# Altium schematic sheet OTHER.SchDoc
size A3; SheetNumber: 3; SheetTotal: 5
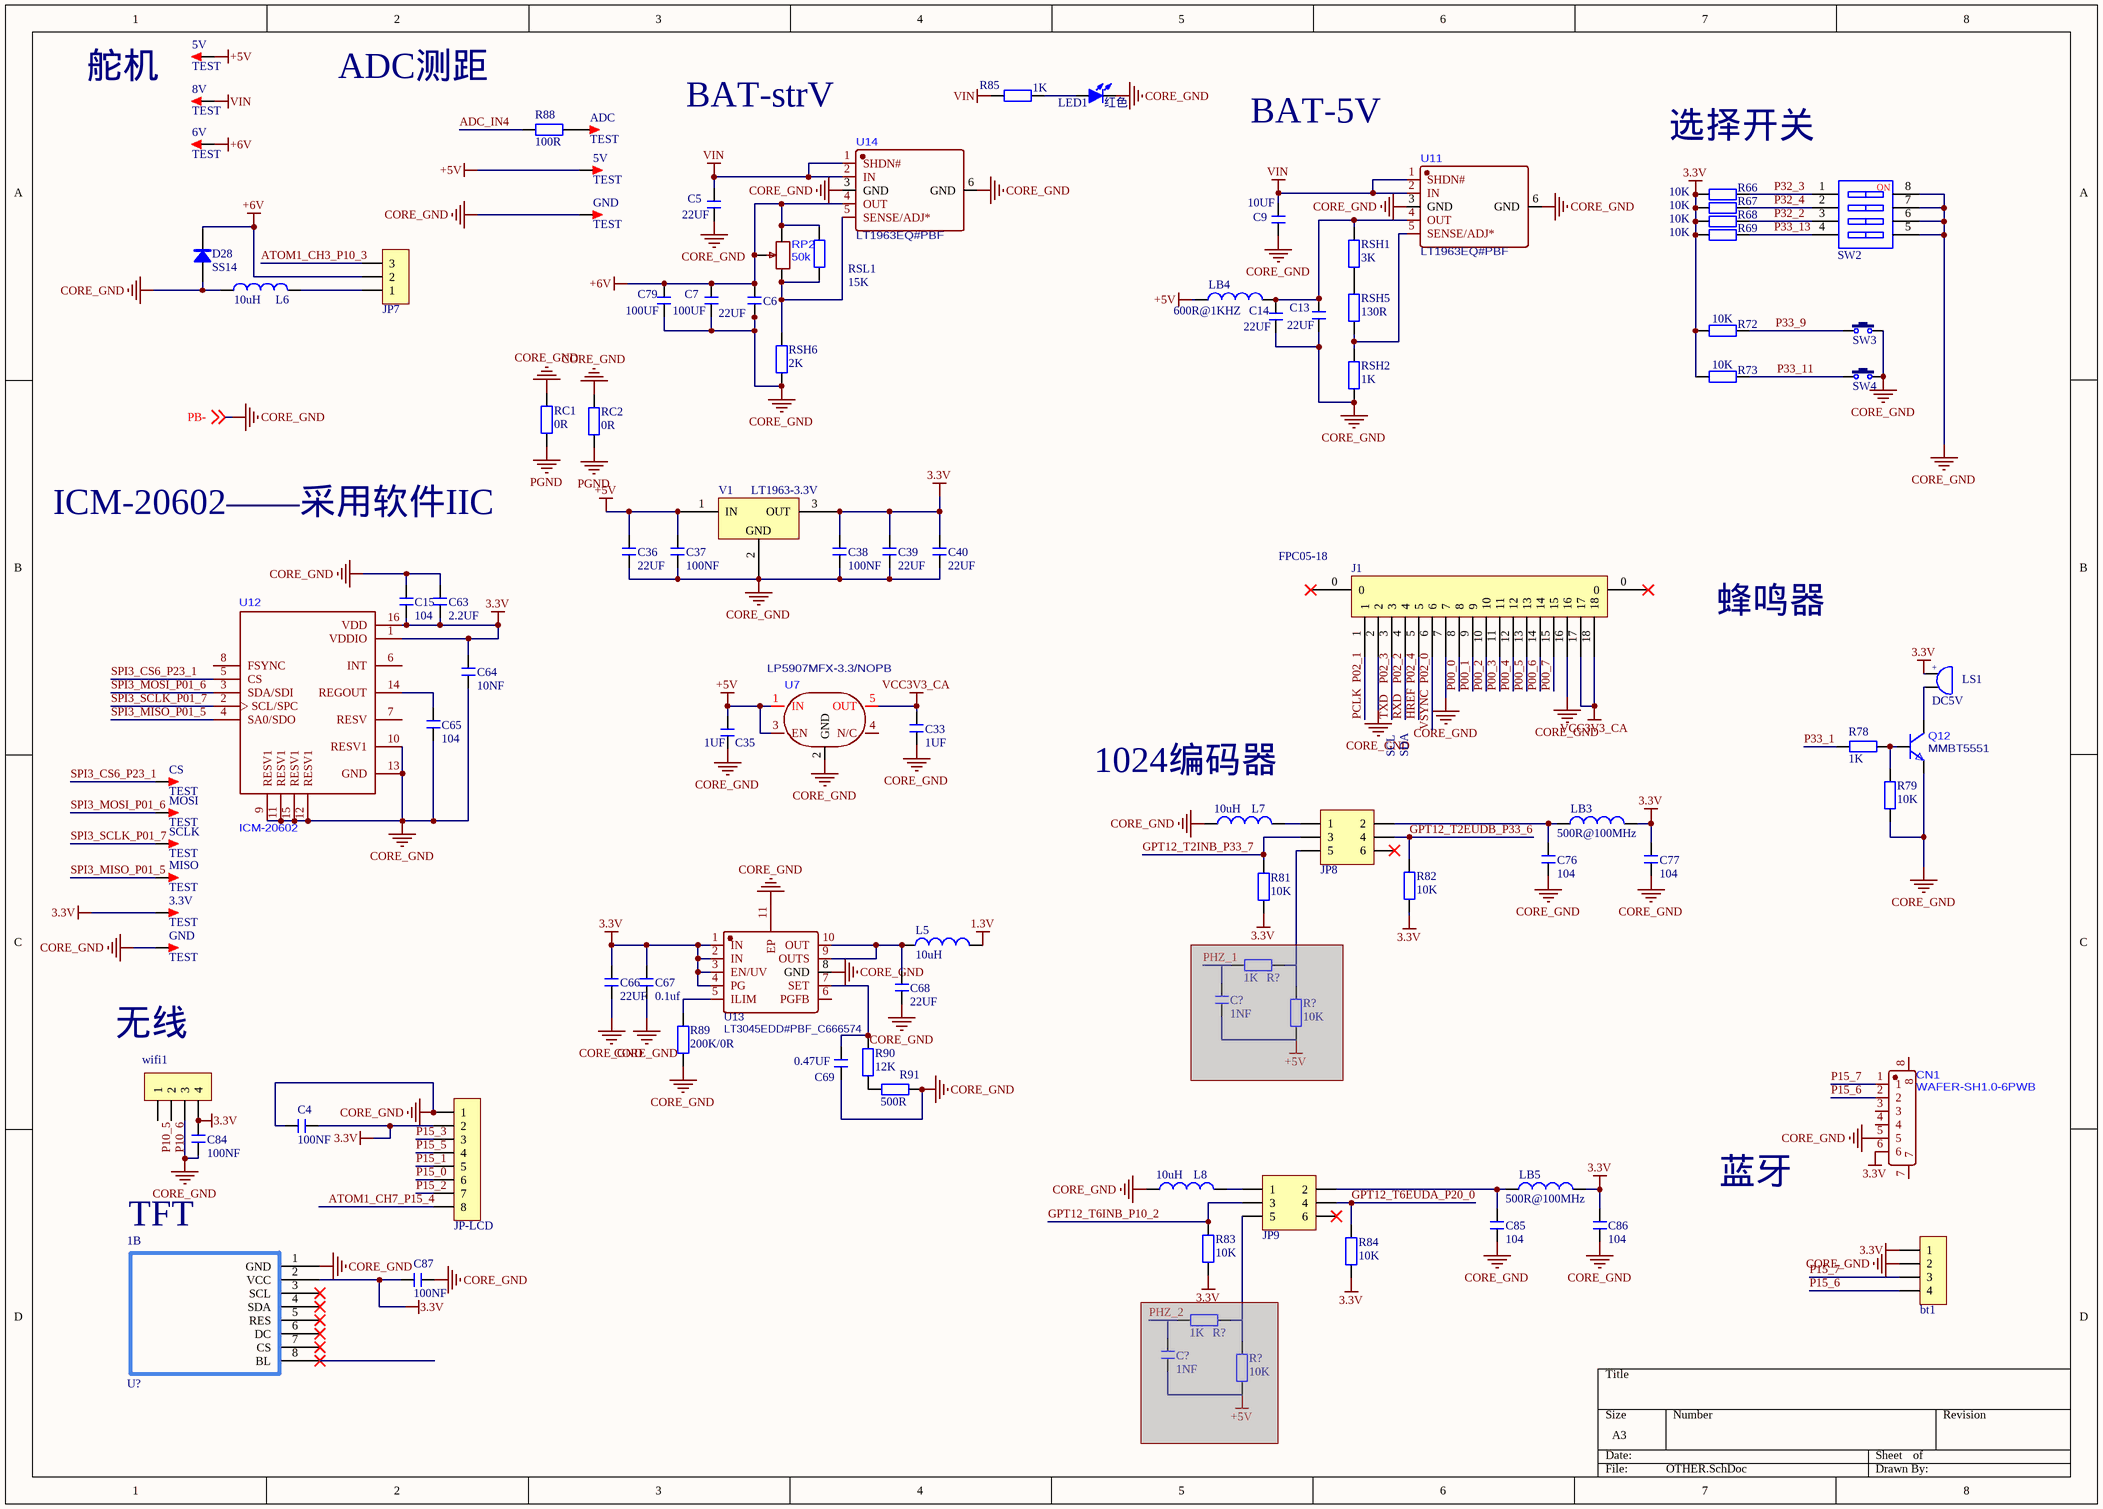
[diagram p0: OTHER.SchDoc]

## Parts
(Parts that share a designator on the sheet are numbered #1, #2 ... from top to bottom, then left to right.)
1  U?  [1.8'TFT]  (part B of 2)
3.3V  TEST  [TEST 0.8]
5V#1  TEST  [TEST 1.6]
5V#2  TEST  [TEST 1]
6V  TEST  [TEST 1.6]
8V  TEST  [TEST 1.6]
ADC  TEST  [TEST 1]
bt1  HDR-1X4  [HDR2.54-LI-4P]  (value not drawn)
C4  100NF  [C 0805_L]
C5  22UF  [C 1206_L]
C6  22UF  [C 1206_L]
C7  100UF  [C 1210_L]
C9  10UF  [C 0805_L]
C13  22UF  [C 1206_L]
C14  22UF  [C 1206_L]
C15  104  [C 0603_L]
C33  1UF  [C 0805_L]
C35  1UF  [C 0805_L]
C36  22UF  [C 1206_L]
C37  100NF  [C 0805_L]
C38  100NF  [C 0805_L]
C39  22UF  [C 1206_L]
C40  22UF  [C 1206_L]
C63  2.2UF  [C 0805_L]
C64  10NF  [C 0805_L]
C65  104  [C 0603_L]
C66  22UF  [C 1206_L]
C67  0.1uf  [C 0805_L]
C68  22UF  [C 1206_L]
C69  0.47UF  [C 0805_L]
C76  104  [C 0805_L]
C77  104  [C 0805_L]
C79  100UF  [C 1210_L]
C84  100NF  [C 0805_L]
C85  104  [C 0805_L]
C86  104  [C 0805_L]
C87  100NF  [C 0805_L]
C?#1  1NF  [C 0603_L]  (masked out: inside a compile mask, not in the netlist)
C?#2  1NF  [C 0603_L]  (masked out: inside a compile mask, not in the netlist)
CN1  WAFER-SH1.0-6PWB  [SH-SMD_6P-P1.00]
CS  TEST  [TEST 0.8]
D28  SS14  [SOD-123F]
GND#1  TEST  [TEST 1]
GND#2  TEST  [TEST 0.8]
J1  FPC05-18  [FPC-05mm-18]
JP7  HDR-1X3  [XH2.54-LI-3P]  (value not drawn)
JP8  Header3X2  [IDC2.54-LI-2x3P]  (value not drawn)
JP9  Header3X2  [IDC2.54-LI-2x3P]  (value not drawn)
JP-LCD  HDR-1X8  [HDR2.54-LI-8P]  (value not drawn)
L5  10uH  [L 0805_L]
L6  10uH  [L 0805_L]
L7  10uH  [L 0805_L]
L8  10uH  [L 0805_L]
LB3  500R@100MHz  [FB 0805_L]
LB4  600R@1KHZ  [L 0805_L]
LB5  500R@100MHz  [FB 0805_L]
LED1  红色  [LED 0805B]
LS1  DC5V  [BEEP 5x9x5.5]
MISO  TEST  [TEST 0.8]
MOSI  TEST  [TEST 0.8]
Q12  MMBT5551  [SOT23-3L]
R66  10K  [R 0805_L]
R67  10K  [R 0805_L]
R68  10K  [R 0805_L]
R69  10K  [R 0805_L]
R72  10K  [R 0805_L]
R73  10K  [R 0805_L]
R78  1K  [R 0805_L]
R79  10K  [R 0805_L]
R81  10K  [R 0805_L]
R82  10K  [R 0805_L]
R83  10K  [R 0805_L]
R84  10K  [R 0805_L]
R85  1K  [R 0805_L]
R88  100R  [R 0805_L]
R89  200K/0R  [R 0603_L]
R90  12K  [R 0805_L]
R91  500R  [R 0805_L]
R?#1  1K  [R 0603_L]  (masked out: inside a compile mask, not in the netlist)
R?#2  10K  [R 0603_L]  (masked out: inside a compile mask, not in the netlist)
R?#3  1K  [R 0603_L]  (masked out: inside a compile mask, not in the netlist)
R?#4  10K  [R 0603_L]  (masked out: inside a compile mask, not in the netlist)
RC1  0R  [R 0805_L]
RC2  0R  [R 0805_L]
RP2  50k  [RES-ADJ-SMD_3224W]
RSH1  3K  [R 0805_L]
RSH2  1K  [R 0805_L]
RSH5  130R  [R 0805_L]
RSH6  2K  [R 0805_L]
RSL1  15K  [R 0805_L]
SCLK  TEST  [TEST 0.8]
SW2  CSW-4P  [CSW DIP-4P]  (value not drawn)
SW3  3x6x5  [TSW SMD-3*6*2.5]  (value not drawn)
SW4  3x6x5  [TSW SMD-3*6*2.5]  (value not drawn)
U7  LP5907MFX-3.3/NOPB  [SOT23-5L]
U11  LT1963EQ#PBF  [DD-PAK-5-leda]
U12  ICM-20602  [LGA-16_L3.0-W3.0-P0.50-BL]
U13  LT3045EDD#PBF_C666574  [LT3045EDD#PBF]
U14  LT1963EQ#PBF  [DD-PAK-5-leda]
V1  LT1963-3.3V  [SOT223_L]
wifi1  HDR-1X4  [HDR2.54-LI-4P]  (value not drawn)

## Nets
1.3V: L5.2
3.3V: 1.2(VCC) 3.3V.1 bt1.1 C4.1 C15.1 C38.2 C39.2 C40.2 C63.1 C64.2 C66.1 C67.1 C77.2 C84.1 C86.2 C87.2 CN1.6 JP-LCD.2 LB3.2 LB5.2 LS1.1 R66.1 R67.1 R68.1 R69.1 R72.1 R73.1 R81.2 R82.2 R83.2 R84.2 U12.1(VDDIO) U12.16(VDD) U13.1(IN) U13.2(IN) U13.3(EN/UV) U13.4(PG) V1.3(OUT) wifi1.4
+5V: 5V#1.1 5V#2.1 C35.1 C36.2 C37.2 LB4.1 U7.1(IN) U7.3(EN) V1.1(IN)
+6V: 6V.1 C6.1 C7.2 C79.2 D28.2(K) JP7.2 RP2.2 RP2.3 RSL1.1 U14.4(OUT)
CORE_GND: 1.1(GND) bt1.2 C4.2 C5.1 C6.2 C7.1 C9.1 C13.1 C14.1 C15.2 C33.2 C35.2 C36.1 C37.1 C38.1 C39.1 C40.1 C63.2 C64.1 C65.1 C66.2 C67.2 C68.2 C69.2 C76.1 C77.1 C79.1 C84.2 C85.1 C86.1 C87.1 CN1.5 D28.1(A) GND#1.1 GND#2.1 J1.2 J1.7 J1.16 JP-LCD.1 L6.1 L7.1 L8.1 LED1.2(K) Q12.2(E) R79.2 R89.2 R91.2 RC1.1 RC2.1 RSH2.2 RSH6.2 SW2.5 SW2.6 SW2.7 SW2.8 SW3.2 SW4.2 U7.2(GND) U11.3(GND) U11.6(GND) U12.9(RESV1) U12.10(RESV1) U12.11(RESV1) U12.12(RESV1) U12.13(GND) U12.15(RESV1) U13.8(GND) U13.11(EP) U14.3(GND) U14.6(GND) V1.2(GND) wifi1.3 ; off-sheet PB-  [also labelled PB-]
PGND: RC1.2 RC2.2
VCC3V3_CA: C33.1 J1.17 J1.18 U7.5(OUT)
VIN: 8V.1 C5.2 C9.2 R85.2 U11.1(SHDN#) U11.2(IN) U14.1(SHDN#) U14.2(IN)
ADC_IN4: R88.2
ATOM1_CH3_P10_3: JP7.3
ATOM1_CH7_P15_4: JP-LCD.8
GPT12_T2EUDB_P33_6: JP8.4 R82.1
GPT12_T2INB_P33_7: JP8.3 R81.1
GPT12_T6EUDA_P20_0: JP9.4 R84.1
GPT12_T6INB_P10_2: JP9.3 R83.1
HREF: J1.5  [also labelled P02_4]
P00_0: J1.8
P00_1: J1.9
P00_2: J1.10
P00_3: J1.11
P00_4: J1.12
P00_5: J1.13
P00_6: J1.14
P00_7: J1.15
P02_0: J1.6  [also labelled VSYNC]
P02_1: J1.1  [also labelled PCLK]
P02_2: J1.4  [also labelled RXD]
P02_3: J1.3  [also labelled TXD]
P10_5: wifi1.1
P10_6: wifi1.2
P15_0: JP-LCD.6
P15_1: JP-LCD.5
P15_2: JP-LCD.7
P15_3: JP-LCD.3
P15_5: JP-LCD.4
P15_6: bt1.4 CN1.2
P15_7: bt1.3 CN1.1
P32_2: R68.2 SW2.3
P32_3: R66.2 SW2.1
P32_4: R67.2 SW2.2
P33_1: R78.2
P33_9: R72.2 SW3.1
P33_11: R73.2 SW4.1
P33_13: R69.2 SW2.4
SPI3_CS6_P23_1: CS.1 U12.5(CS)
SPI3_MISO_P01_5: MISO.1 U12.4(SA0/SDO)
SPI3_MOSI_P01_6: MOSI.1 U12.3(SDA/SDI)
SPI3_SCLK_P01_7: SCLK.1 U12.2(SCL/SPC)
NetADC_1: ADC.1 R88.1
NetC13_2: C13.2 C14.2 LB4.2 RSH1.1 U11.4(OUT)
NetC65_2: C65.2 U12.14(REGOUT)
NetC68_1: C68.1 L5.1 U13.9(OUTS) U13.10(OUT)
NetC69_1: C69.1 R90.1 U13.7(SET)
NetC76_2: C76.2 JP8.2 LB3.1
NetC85_2: C85.2 JP9.2 LB5.1
NetJP7_1: JP7.1 L6.2
NetJP8_1: JP8.1 L7.2
NetJP9_1: JP9.1 L8.2
NetLED1_1: LED1.1(A) R85.1
NetLS1_2: LS1.2 Q12.3(C)
NetQ12_1: Q12.1(B) R78.1 R79.1
NetR89_1: R89.1 U13.5(ILIM)
NetR90_2: R90.2 R91.1
NetRP2_1: RP2.1 RSH6.1 RSL1.2 U14.5(SENSE/ADJ*)
NetRSH1_2: RSH1.2 RSH5.1
NetRSH2_1: RSH2.1 RSH5.2 U11.5(SENSE/ADJ*)

Not connected (* = marked no-connect by the designer): 1 3(SCL)* 4(SDA)* 5(RES)* 6(DC)* 7(CS)* 8(BL)*; CN1 3 4 7 8; J1 0*; JP8 5 6*; JP9 5 6*; U7 4(N/C); U12 6(INT) 7(RESV) 8(FSYNC); U13 6(PGFB)

## Notes on the sheet
- 舵机
- ADC测距
- (near U14) BAT-strV
- BAT-5V
- 选择开关
- ICM-20602——采用软件IIC
- 蜂鸣器
- (near L7) 1024编码器
- SCL
- SDA
- 无线
- 蓝牙
- TFT
- (in symbol BEEP) +
- (in symbol CSW-4P) NO

## Library data of the parts
1 = 1.8'TFT
3.3V 5V#1 5V#2 6V 8V ADC CS GND#1 GND#2 MISO MOSI SCLK = TEST: 测试点; 版权归属: 源创客; BOM名称: 测试点; 学习资源: www.ooocke.com
bt1 wifi1 = Header 4: 4P接插件; 版权归属: 源创客; BOM名称: 4P接插件; 学习资源: www.ooocke.com
C4-C7 C9 C13-C15 C33 C35-C40 C63-C69 C76 C77 C79 C84-C87 C?#1 C?#2 = C: 无极性贴片电容; 版权归属: 源创客; 材质: X7R; BOM名称: 无极性贴片电容; 学习资源: www.ooocke.com
D28 = SS24: 肖特基二极管; 版权归属: 源创客; 属性: 40V/2A; BOM名称: 肖特基二极管; 学习资源: www.ooocke.com
JP7 = Header 3: 3P接插件; 版权归属: 源创客; BOM名称: 3P接插件; 学习资源: www.ooocke.com
JP8 JP9 = Header 3X2: 3*2P接插件; 版权归属: 源创客; BOM名称: 3*2P接插件; 学习资源: www.ooocke.com
JP-LCD = Header 8: 8P接插件; 版权归属: 源创客; BOM名称: 8P接插件; 学习资源: www.ooocke.com
L5-L8 = L: 小功率贴片电感; 版权归属: 源创客; BOM名称: 小功率贴片电感; 学习资源: www.ooocke.com
LB3-LB5 = LB: 磁珠; 版权归属: 源创客; BOM名称: 磁珠; 学习资源: www.ooocke.com
LED1 = LED-SMD: 贴片LED; 版权归属: 源创客; BOM名称: 贴片LED; 学习资源: www.ooocke.com
LS1 = BEEP: 蜂鸣器; 版权归属: 源创客; BOM名称: 蜂鸣器; 学习资源: www.ooocke.com
R66-R69 R72 R73 R78 R79 R81-R85 R88-R91 R?#1-R?#4 RC1 RC2 RSH1 RSH2 RSH5 RSH6 RSL1 = R: 贴片电阻; 版权归属: 源创客; BOM名称: 贴片电阻; 学习资源: www.ooocke.com
RP2 = 3224W-1-503E
SW2 = CSW-4P: 4路编码开关; 版权归属: 源创客; BOM名称: 4路编码开关; 学习资源: www.ooocke.com
SW3 SW4 = TSW 3x6: 3x6轻触开关; 版权归属: 源创客; BOM名称: 3x6轻触开关; 学习资源: www.ooocke.com
U7 = LP5907MFX-1.8/NOPB
U13 = LT3045EDD#PBF_C666574: BOM_Manufacturer: Analog Devices; Contributor: LCSC; BOM_Supplier: LCSC; BOM_Supplier Part: C666574; BOM_Manufacturer Part: LT3045EDD#PBF; BOM_JLCPCB Part Class: Extended Part; spicePre: U; spiceSymbolName: LT3045EDD#PBF_C666574
V1 = LM2940: 5V稳压芯片; 版权归属: 源创客; BOM名称: 5V稳压芯片; 学习资源: www.ooocke.com